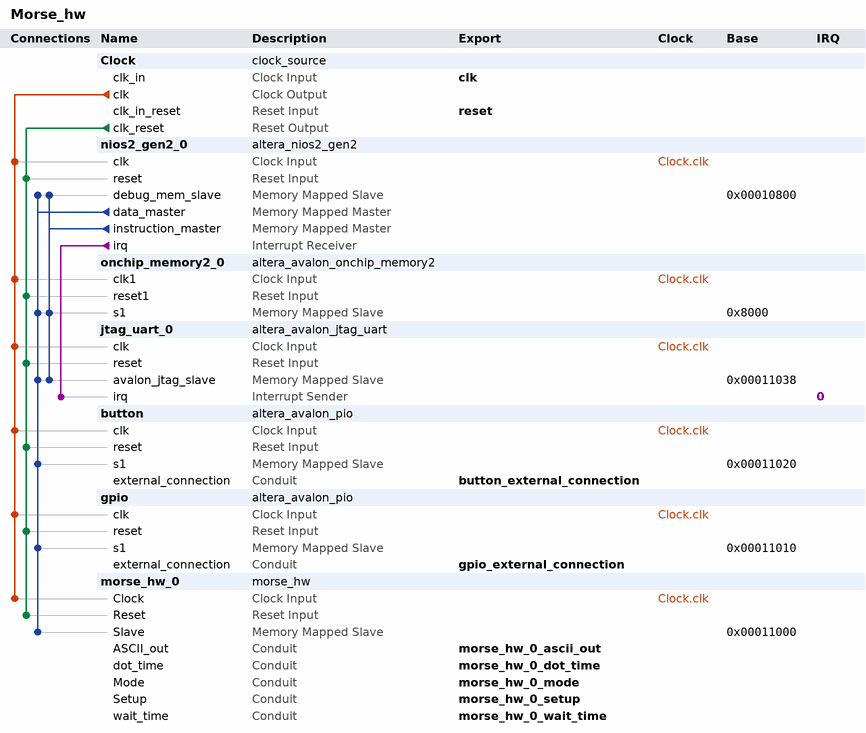
[diagram p0: system contents]
# Platform Designer (Qsys) system Morse_hw, Cyclone V 5CSXFC6D6F31C6
# Parameters at their usual value, and those the tool derives, are not listed.
package require -exact qsys 20.1
create_system Morse_hw
set_project_property DEVICE_FAMILY {Cyclone V}
set_project_property DEVICE 5CSXFC6D6F31C6

add_instance Clock clock_source 20.1
set_instance_parameter_value Clock clockFrequency 50000000
set_instance_parameter_value Clock resetSynchronousEdges DEASSERT

add_instance nios2_gen2_0 altera_nios2_gen2 20.1
set_instance_parameter_value nios2_gen2_0 dcache_size 2048
set_instance_parameter_value nios2_gen2_0 exceptionSlave onchip_memory2_0.s1
set_instance_parameter_value nios2_gen2_0 icache_size 4096
set_instance_parameter_value nios2_gen2_0 impl Tiny
set_instance_parameter_value nios2_gen2_0 resetSlave onchip_memory2_0.s1

add_instance onchip_memory2_0 altera_avalon_onchip_memory2 20.1
set_instance_parameter_value onchip_memory2_0 dataWidth 32
set_instance_parameter_value onchip_memory2_0 dualPort false
set_instance_parameter_value onchip_memory2_0 initMemContent true
set_instance_parameter_value onchip_memory2_0 initializationFileName onchip_mem.hex
set_instance_parameter_value onchip_memory2_0 memorySize 32768

add_instance jtag_uart_0 altera_avalon_jtag_uart 20.1
set_instance_parameter_value jtag_uart_0 simInteractiveOptions NO_INTERACTIVE_WINDOWS

add_instance button altera_avalon_pio 20.1
set_instance_parameter_value button direction Input
set_instance_parameter_value button simDoTestBenchWiring true
set_instance_parameter_value button width 3

add_instance gpio altera_avalon_pio 20.1
set_instance_parameter_value gpio direction Output
set_instance_parameter_value gpio width 16

add_instance morse_hw_0 morse_hw 3.0
set_instance_parameter_value morse_hw_0 DOT_TIME 25000000
set_instance_parameter_value morse_hw_0 WAIT_TIME 50000000

# connections
add_connection Clock.clk button.clk clock
add_connection Clock.clk gpio.clk clock
add_connection Clock.clk jtag_uart_0.clk clock
add_connection Clock.clk morse_hw_0.Clock clock
add_connection Clock.clk nios2_gen2_0.clk clock
add_connection Clock.clk onchip_memory2_0.clk1 clock
add_connection Clock.clk_reset button.reset reset
add_connection Clock.clk_reset gpio.reset reset
add_connection Clock.clk_reset jtag_uart_0.reset reset
add_connection Clock.clk_reset morse_hw_0.Reset reset
add_connection Clock.clk_reset nios2_gen2_0.reset reset
add_connection Clock.clk_reset onchip_memory2_0.reset1 reset
add_connection nios2_gen2_0.data_master button.s1 avalon
set_connection_parameter_value nios2_gen2_0.data_master/button.s1 baseAddress 0x00011020
add_connection nios2_gen2_0.data_master gpio.s1 avalon
set_connection_parameter_value nios2_gen2_0.data_master/gpio.s1 baseAddress 0x00011010
add_connection nios2_gen2_0.data_master jtag_uart_0.avalon_jtag_slave avalon
set_connection_parameter_value nios2_gen2_0.data_master/jtag_uart_0.avalon_jtag_slave baseAddress 0x00011038
add_connection nios2_gen2_0.data_master morse_hw_0.Slave avalon
set_connection_parameter_value nios2_gen2_0.data_master/morse_hw_0.Slave baseAddress 0x00011000
add_connection nios2_gen2_0.data_master nios2_gen2_0.debug_mem_slave avalon
set_connection_parameter_value nios2_gen2_0.data_master/nios2_gen2_0.debug_mem_slave baseAddress 0x00010800
add_connection nios2_gen2_0.data_master onchip_memory2_0.s1 avalon
set_connection_parameter_value nios2_gen2_0.data_master/onchip_memory2_0.s1 baseAddress 0x8000
add_connection nios2_gen2_0.instruction_master jtag_uart_0.avalon_jtag_slave avalon
set_connection_parameter_value nios2_gen2_0.instruction_master/jtag_uart_0.avalon_jtag_slave baseAddress 0x00011038
add_connection nios2_gen2_0.instruction_master nios2_gen2_0.debug_mem_slave avalon
set_connection_parameter_value nios2_gen2_0.instruction_master/nios2_gen2_0.debug_mem_slave baseAddress 0x00010800
add_connection nios2_gen2_0.instruction_master onchip_memory2_0.s1 avalon
set_connection_parameter_value nios2_gen2_0.instruction_master/onchip_memory2_0.s1 baseAddress 0x8000
add_connection nios2_gen2_0.irq jtag_uart_0.irq interrupt
set_connection_parameter_value nios2_gen2_0.irq/jtag_uart_0.irq irqNumber 0

# exported interfaces
add_interface button_external_connection conduit end
set_interface_property button_external_connection EXPORT_OF button.external_connection
add_interface clk clock sink
set_interface_property clk EXPORT_OF Clock.clk_in
add_interface gpio_external_connection conduit end
set_interface_property gpio_external_connection EXPORT_OF gpio.external_connection
add_interface morse_hw_0_ascii_out conduit end
set_interface_property morse_hw_0_ascii_out EXPORT_OF morse_hw_0.ASCII_out
add_interface morse_hw_0_dot_time conduit end
set_interface_property morse_hw_0_dot_time EXPORT_OF morse_hw_0.dot_time
add_interface morse_hw_0_mode conduit end
set_interface_property morse_hw_0_mode EXPORT_OF morse_hw_0.Mode
add_interface morse_hw_0_setup conduit end
set_interface_property morse_hw_0_setup EXPORT_OF morse_hw_0.Setup
add_interface morse_hw_0_wait_time conduit end
set_interface_property morse_hw_0_wait_time EXPORT_OF morse_hw_0.wait_time
add_interface reset reset sink
set_interface_property reset EXPORT_OF Clock.clk_in_reset

set_interconnect_requirement {$system} qsys_mm.clockCrossingAdapter HANDSHAKE
set_interconnect_requirement {$system} qsys_mm.enableEccProtection FALSE
set_interconnect_requirement {$system} qsys_mm.insertDefaultSlave FALSE
set_interconnect_requirement {$system} qsys_mm.maxAdditionalLatency 1

save_system Morse_hw.qsys
